# EAGLE design Wasserstandsmelder1 (EAGLE 5.04)
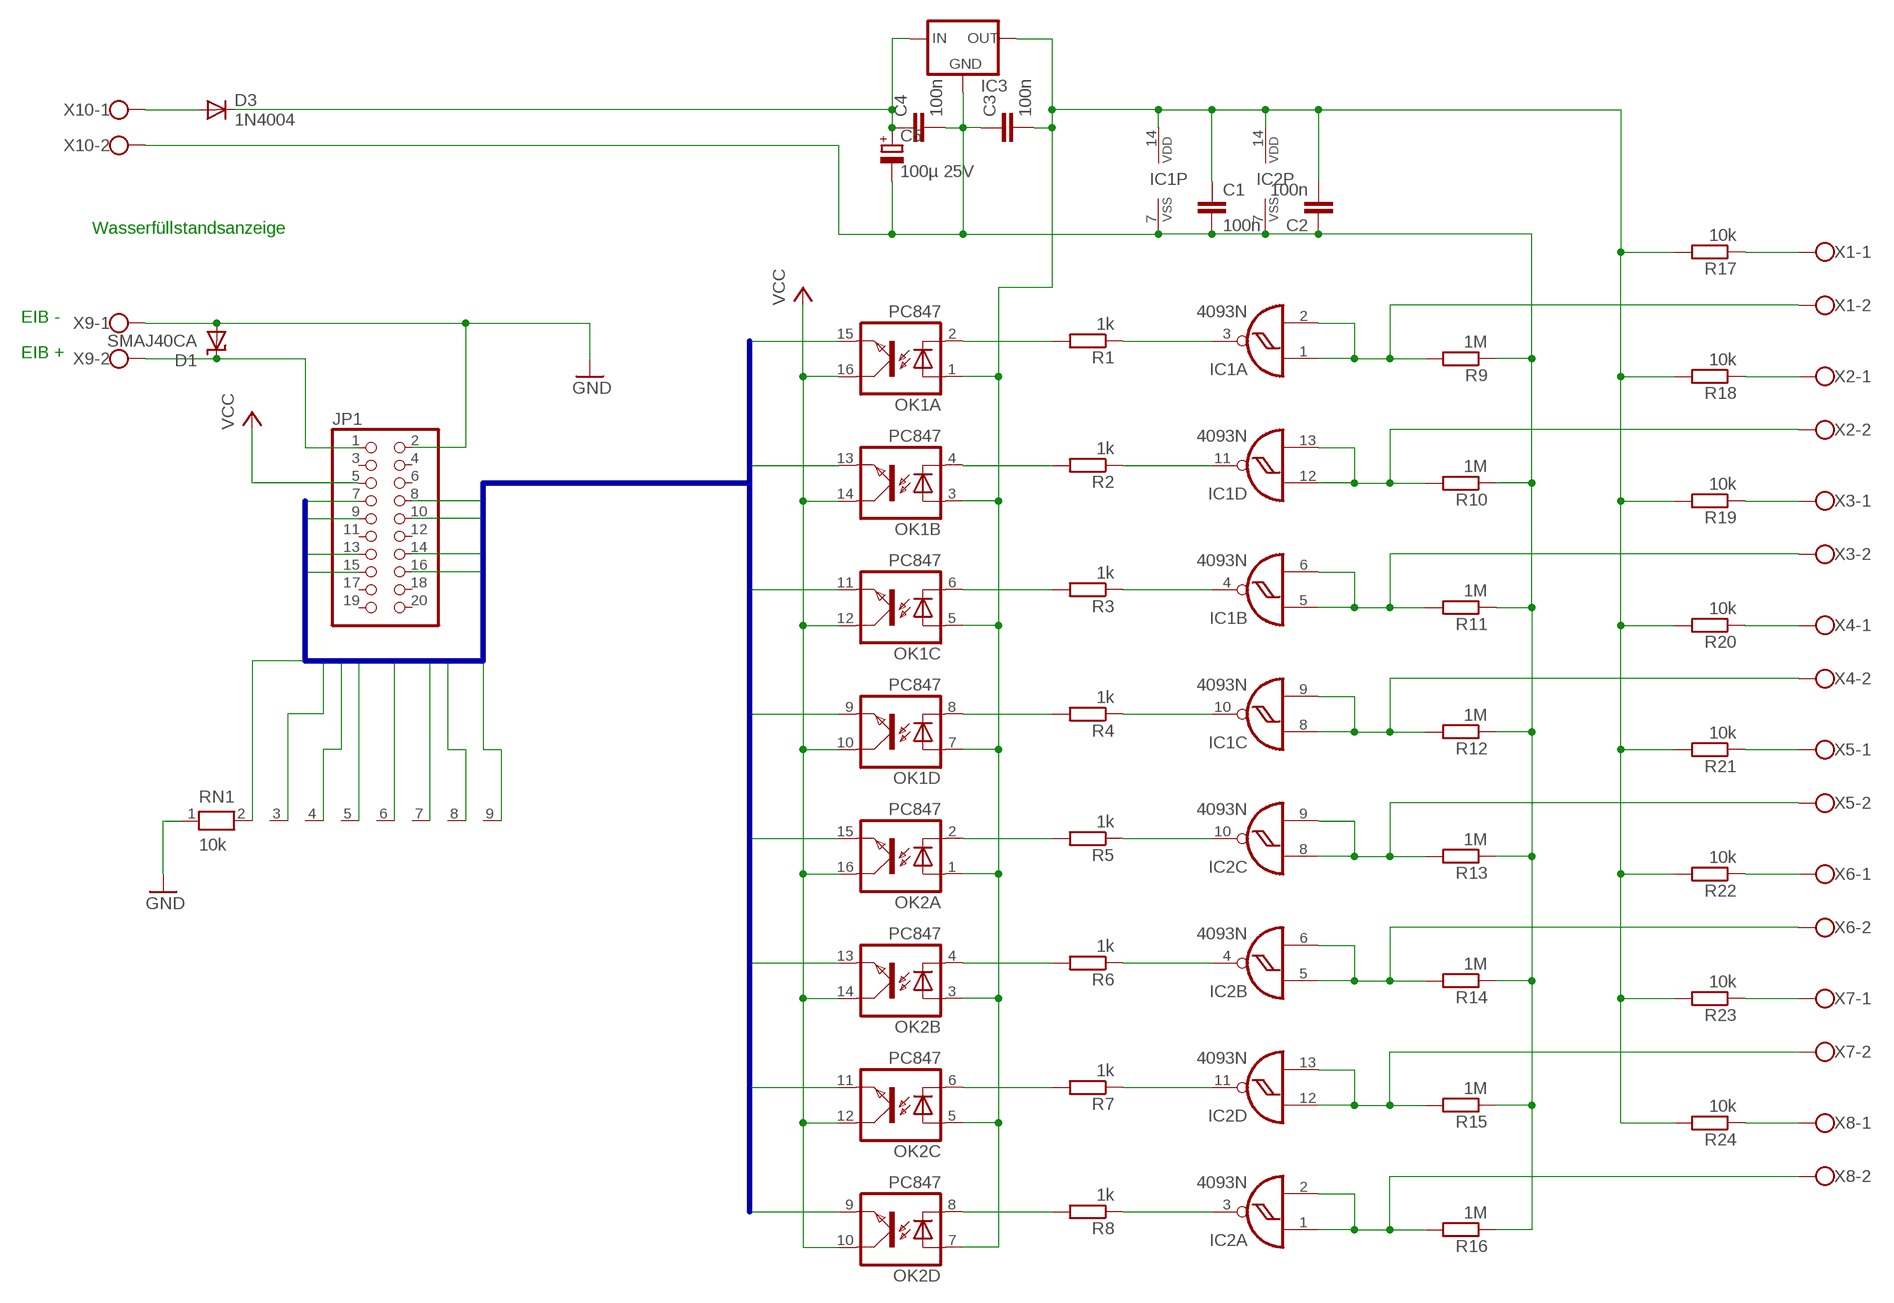
[diagram p0: schematic, sheet 1]

## Parts
C1  100n  C-EU050-024X044  [C050-024X044]
C2  100n  C-EU050-024X044  [C050-024X044]
C3  100n  C-EU050-024X044  [C050-024X044]
C4  100n  C-EU050-024X044  [C050-024X044]
C5  100µ 25V  CPOL-EUE3.5-8  [E3,5-8]
D1  SMAJ40CA  SUPPRESSOR-SMBJ  [SMBJ]
D3  1N4004  [DO41-10]
IC1  4093N  [DIL14]
IC2  4093N  [DIL14]
IC3  78XXS  [78XXS]
JP1  PINHD-2X10  [2X10]
OK1  PC847  [DIL16]
OK2  PC847  [DIL16]
R1  1k  R-EU_0204/7  [0204/7]
R2  1k  R-EU_0204/7  [0204/7]
R3  1k  R-EU_0204/7  [0204/7]
R4  1k  R-EU_0204/7  [0204/7]
R5  1k  R-EU_0204/7  [0204/7]
R6  1k  R-EU_0204/7  [0204/7]
R7  1k  R-EU_0204/7  [0204/7]
R8  1k  R-EU_0204/7  [0204/7]
R9  1M  R-EU_0204/7  [0204/7]
R10  1M  R-EU_0204/7  [0204/7]
R11  1M  R-EU_0204/7  [0204/7]
R12  1M  R-EU_0204/7  [0204/7]
R13  1M  R-EU_0204/7  [0204/7]
R14  1M  R-EU_0204/7  [0204/7]
R15  1M  R-EU_0204/7  [0204/7]
R16  1M  R-EU_0204/7  [0204/7]
R17  10k  R-EU_0204/7  [0204/7]
R18  10k  R-EU_0204/7  [0204/7]
R19  10k  R-EU_0204/7  [0204/7]
R20  10k  R-EU_0204/7  [0204/7]
R21  10k  R-EU_0204/7  [0204/7]
R22  10k  R-EU_0204/7  [0204/7]
R23  10k  R-EU_0204/7  [0204/7]
R24  10k  R-EU_0204/7  [0204/7]
RN1  10k  RN08  [RN-9]
X1  W237-02P  [W237-132]
X2  W237-02P  [W237-132]
X3  W237-02P  [W237-132]
X4  W237-02P  [W237-132]
X5  W237-02P  [W237-132]
X6  W237-02P  [W237-132]
X7  W237-02P  [W237-132]
X8  W237-02P  [W237-132]
X9  W237-102  [W237-102]
X10  W237-02P  [W237-132]

## Nets
GND: D1.A JP1.2 RN1.1 X9.1
IO1: JP1.7 OK1.15(A:EMIT) RN1.9
IO2: JP1.8 OK1.13(B:EMIT) RN1.8
IO3: JP1.9 OK1.11(C:EMIT) RN1.7
IO4: JP1.10 OK1.9(D:EMIT) RN1.6
IO5: JP1.13 OK2.15(A:EMIT) RN1.5
IO6: JP1.14 OK2.13(B:EMIT) RN1.4
IO7: JP1.15 OK2.11(C:EMIT) RN1.3
IO8: JP1.16 OK2.9(D:EMIT) RN1.2
N$1: OK1.2(A:C) R1.2
N$2: IC1.1(A:I0) IC1.2(A:I1) R9.2 X1.2
N$3: IC1.12(D:I0) IC1.13(D:I1) R10.2 X2.2
N$4: IC1.5(B:I0) IC1.6(B:I1) R11.2 X3.2
N$5: D3.A X10.1
N$6: IC1.8(C:I0) IC1.9(C:I1) R12.2 X4.2
N$7: IC2.8(C:I0) IC2.9(C:I1) R13.2 X5.2
N$8: IC2.5(B:I0) IC2.6(B:I1) R14.2 X6.2
N$9: IC2.12(D:I0) IC2.13(D:I1) R15.2 X7.2
N$10: IC2.1(A:I0) IC2.2(A:I1) R16.2 X8.2
N$11: R17.1 X1.1
N$12: R18.1 X2.1
N$13: R19.1 X3.1
N$14: R20.1 X4.1
N$15: R21.1 X5.1
N$16: R22.1 X6.1
N$17: R23.1 X7.1
N$18: R24.1 X8.1
N$19: IC1.10(C:O) R4.1
N$20: OK1.4(B:C) R2.2
N$21: IC1.3(A:O) R1.1
N$22: OK1.6(C:C) R3.2
N$23: IC1.11(D:O) R2.1
N$24: OK1.8(D:C) R4.2
N$25: IC1.4(B:O) R3.1
N$26: OK2.2(A:C) R5.2
N$27: IC2.10(C:O) R5.1
N$28: OK2.4(B:C) R6.2
N$29: IC2.4(B:O) R6.1
N$30: OK2.6(C:C) R7.2
N$31: IC2.11(D:O) R7.1
N$32: OK2.8(D:C) R8.2
N$33: IC2.3(A:O) R8.1
N$35: C4.1 C5.+ D3.C IC3.IN
N$38: D1.C JP1.1 X9.2
VCC: JP1.5 OK1.10(D:COL) OK1.12(C:COL) OK1.14(B:COL) OK1.16(A:COL) OK2.10(D:COL) OK2.12(C:COL) OK2.14(B:COL) OK2.16(A:COL)
VDD: C1.1 C2.2 C3.2 IC1.14(P:VDD) IC2.14(P:VDD) IC3.OUT OK1.1(A:A) OK1.3(B:A) OK1.5(C:A) OK1.7(D:A) OK2.1(A:A) OK2.3(B:A) OK2.5(C:A) OK2.7(D:A) R17.2 R18.2 R19.2 R20.2 R21.2 R22.2 R23.2 R24.2
VSS: C1.2 C2.1 C3.1 C4.2 C5.- IC1.7(P:VSS) IC2.7(P:VSS) IC3.GND R9.1 R10.1 R11.1 R12.1 R13.1 R14.1 R15.1 R16.1 X10.2
Unconnected: JP1.3 JP1.4 JP1.6 JP1.11 JP1.12 JP1.17 JP1.18 JP1.19 JP1.20

## Buses
IO[1..8]

## Notes on the sheet
- Wasserfüllstandsanzeige
- EIB -
- EIB +

## Library data of the parts
C1-C4 = rcl:C-EU: CAPACITOR, European symbol
C5 = rcl:CPOL-EU: POLARIZED CAPACITOR, European symbol
D1 = diode:SUPPRESSOR-: Suppressor diode
D3 = diode:1N4004: DIODE general purpose rectifier, 1 A
IC1 IC2 = 40xx:4093: Quad 2-input NAND schmitt trigger
IC3 = v-reg:78XXS: VOLTAGE REGULATOR
JP1 = pinhead:PINHD-2X10: PIN HEADER
OK1 OK2 = optocoupler:PC847: SHARP OPTO COUPLER
R1-R24 = rcl:R-EU_: RESISTOR, European symbol
RN1 = resistor-net:RN08: RESISTOR NETWORK
X1-X8 X10 = con-wago-508:W237-02P: WAGO SREW CLAMP
X9 = con-wago-500:W237-102: WAGO SCREW CLAMP

## Board
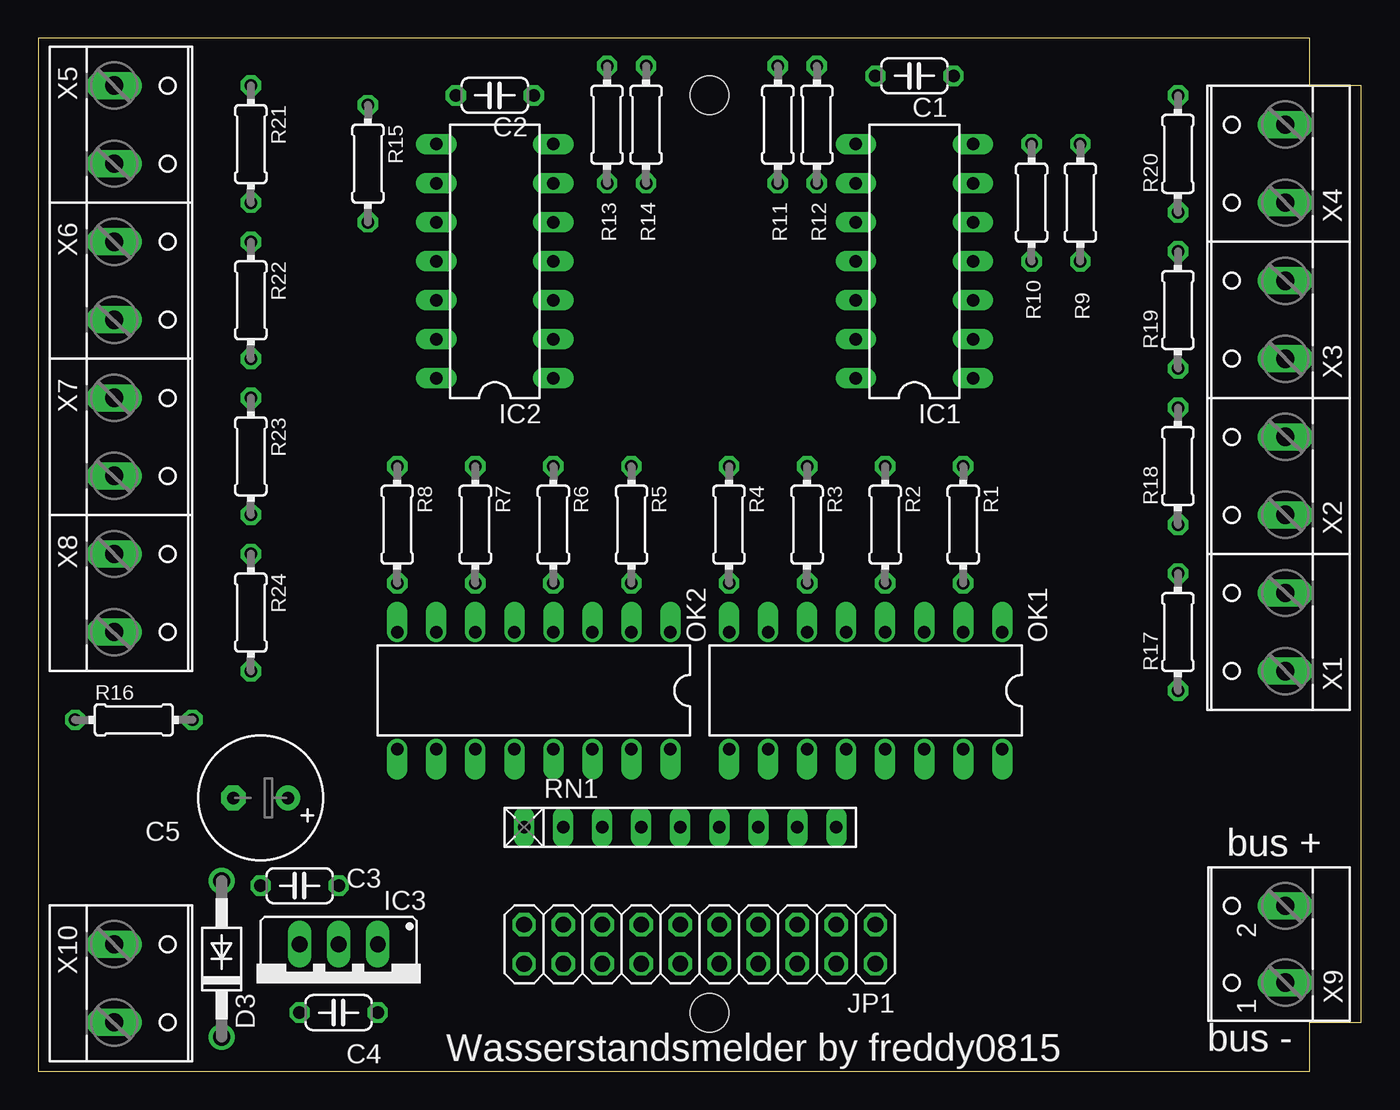
[diagram p1: board, top side]
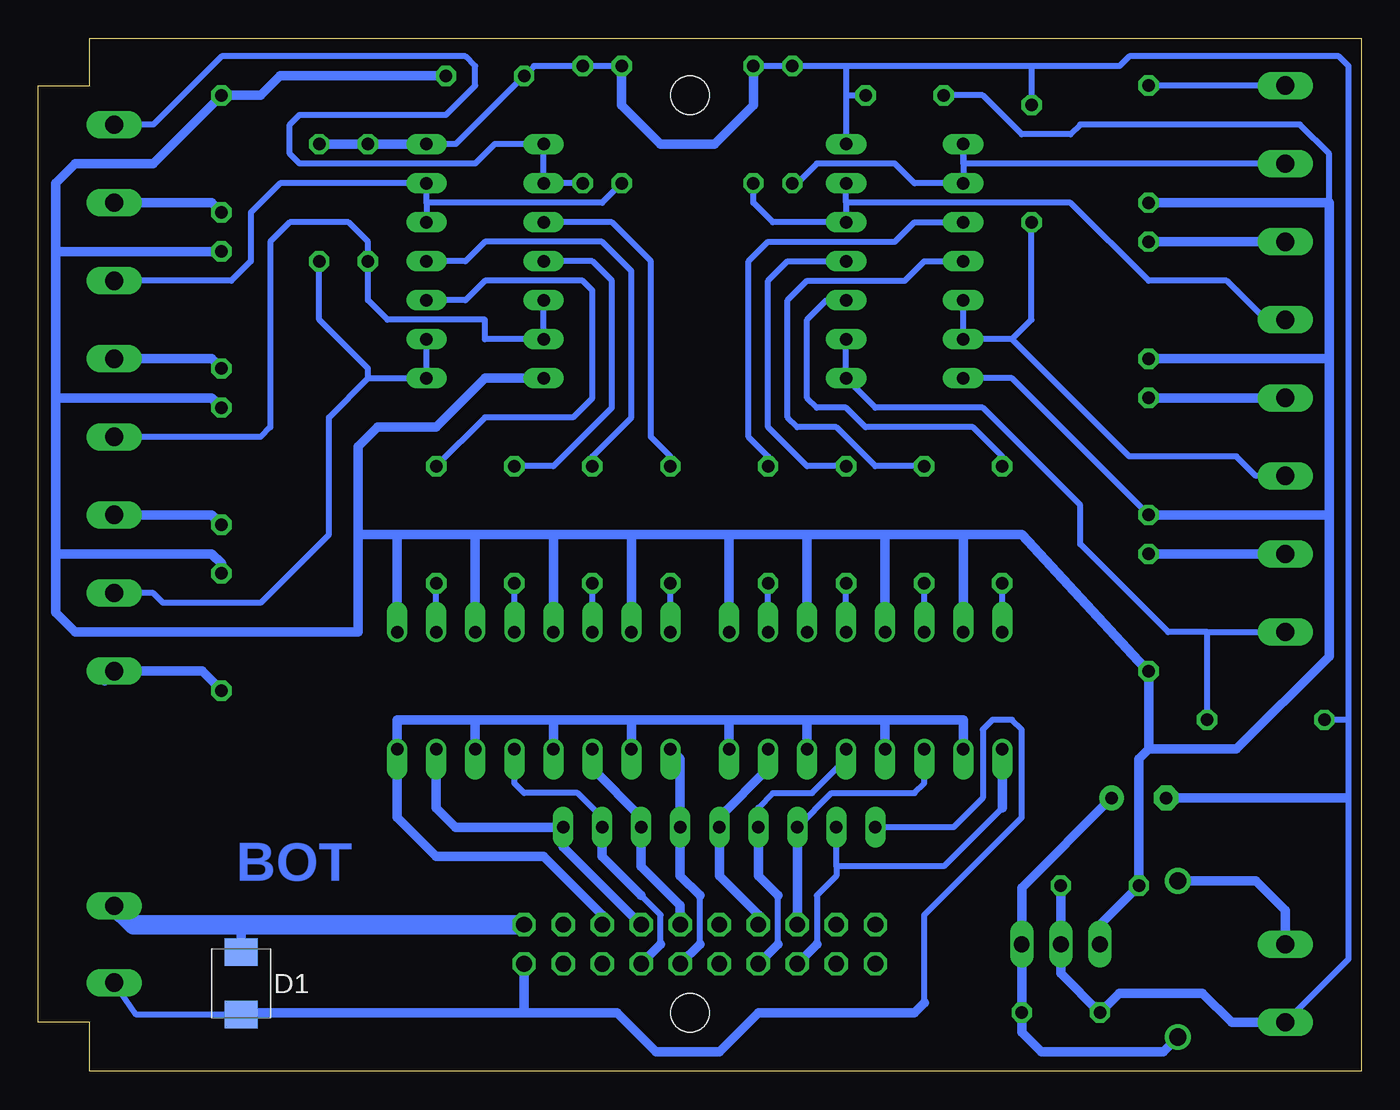
[diagram p2: board, bottom side, seen from below]

Size 86.07 x 67.2 mm. Coordinates in mm from the lower left corner, seen from the top.
Outline: 0,0.01 82.72,0 82.72,3.18 86.07,3.18 86.07,64.13 82.72,64.13 82.72,67.2 0,67.2 0,0.01
Copper layers (1*16): Top 0.035mm / dielectric 1.5mm / Bottom 0.035mm
Design rules "default *": minimum track width 10mil, minimum drill 24mil, track to track 8mil, track to pad 8mil, pad to pad 16mil, via to via 16mil, smd to smd 16mil, copper to edge 20mil, drill to drill 10mil, minimum pad ring 10mil, minimum via ring 8mil, stop-mask expansion 4mil, vias tented up to drill 0mil, thermal gap 10mil
Holes 2.5 mm at 43.67,63.5 43.67,3.81

### Footprints (pad centres in the part's own frame; a part is rotated, then mirrored left to right if it is on the bottom)
C050-024X044 = drill 0.813 octagon: 1 -2.54,0; 2 2.54,0
E3,5-8 = drill 0.813 pad 1.6 round: + -1.778,0 | drill 0.813 pad 1.6 octagon: - 1.778,0
SMBJ = smd 1.78 x 2.16: A 2.04,0; C -2.03,0
DO41-10 = drill 1.118 round: A 5.08,0; C -5.08,0
DIL14 = drill 0.813 long: 1 -7.62,-3.81; 2 -5.08,-3.81; 3 -2.54,-3.81; 4 0,-3.81; 5 2.54,-3.81; 6 5.08,-3.81; 7 7.62,-3.81; 8 7.62,3.81; 9 5.08,3.81; 10 2.54,3.81; 11 0,3.81; 12 -2.54,3.81; 13 -5.08,3.81; 14 -7.62,3.81
78XXS = drill 1.016 long: GND 0,-2.54; IN -2.54,-2.54; OUT 2.54,-2.54
2X10 = drill 1.016 octagon: 1 -11.43,-1.27; 2 -11.43,1.27; 3 -8.89,-1.27; 4 -8.89,1.27; 5 -6.35,-1.27; 6 -6.35,1.27; 7 -3.81,-1.27; 8 -3.81,1.27; 9 -1.27,-1.27; 10 -1.27,1.27; 11 1.27,-1.27; 12 1.27,1.27; 13 3.81,-1.27; 14 3.81,1.27; 15 6.35,-1.27; 16 6.35,1.27; 17 8.89,-1.27; 18 8.89,1.27; 19 11.43,-1.27; 20 11.43,1.27
DIL16 = drill 0.813 offset: 1 -8.89,-3.81; 2 -6.35,-3.81; 3 -3.81,-3.81; 4 -1.27,-3.81; 5 1.27,-3.81; 6 3.81,-3.81; 7 6.35,-3.81; 8 8.89,-3.81; 9 8.89,3.81; 10 6.35,3.81; 11 3.81,3.81; 12 1.27,3.81; 13 -1.27,3.81; 14 -3.81,3.81; 15 -6.35,3.81; 16 -8.89,3.81
0204/7 = drill 0.813 octagon: 1 -3.81,0; 2 3.81,0
RN-9 = drill 0.813 long: 1 -10.16,0; 2 -7.62,0; 3 -5.08,0; 4 -2.54,0; 5 0,0; 6 2.54,0; 7 5.08,0; 8 7.62,0; 9 10.16,0
W237-132 = drill 1.194 long: 1 -2.54,-0.635; 2 2.54,-0.635
W237-102 = drill 1.194 long: 1 -2.5,-1.27; 2 2.5,-1.27

### Placement (x,y rotation side)
C1  57,64.77 180 top
C2  29.7,63.5 180 top
C3  17,12.06 180 top
C4  19.54,3.81 180 top
C5  14.46,17.78 180 top
D1  72.88,5.71 270 bottom
D3  11.92,7.3 90 top
IC1  57,52.7 90 top
IC2  29.7,52.7 90 top
IC3  19.54,5.71 180 top
JP1  43.03,8.26 180 top
OK1  53.83,24.77 180 top
OK2  32.24,24.77 180 top
R1  60.18,35.56 270 top
R2  55.1,35.56 270 top
R3  50.02,35.56 270 top
R4  44.94,35.56 270 top
R5  38.59,35.56 270 top
R6  33.51,35.56 270 top
R7  28.43,35.56 270 top
R8  23.35,35.56 270 top
R9  67.8,56.52 270 top
R10  64.62,56.52 270 top
R11  48.11,61.59 270 top
R12  50.65,61.59 270 top
R13  37,61.59 270 top
R14  39.54,61.59 270 top
R15  21.44,59.05 270 top
R16  6.2,22.86 0 top
R17  74.15,28.58 90 top
R18  74.15,39.37 90 top
R19  74.15,49.53 90 top
R20  74.15,59.69 90 top
R21  13.82,60.32 270 top
R22  13.82,50.16 270 top
R23  13.82,40 270 top
R24  13.82,29.85 270 top
RN1  41.76,15.88 0 top
X1  80.5,28.58 90 top
X2  80.5,38.73 90 top
X3  80.5,48.89 90 top
X4  80.5,59.05 90 top
X5  5.57,61.59 270 top
X6  5.57,51.43 270 top
X7  5.57,41.27 270 top
X8  5.57,31.12 270 top
X9  79.86,8.26 90 top
X10  5.57,5.71 270 top

### Tracks (layer width: path | path; a pad name or v marks a point on that pad's centre or on a via)
GND
  Bottom 0.406: D1.A 79.69,3.67 X9.1 | 28.43,4.45 28.43,10.16 22.08,16.51 22.08,22.23 22.71,22.86 23.98,22.86 24.62,22.23 24.62,17.78 26.52,15.88 RN1.1
  Bottom 0.61: 54.46,3.81 JP1.2 | 54.46,3.81 72.74,3.81 D1.A | 54.46,3.81 48.43,3.81 45.89,1.27 41.76,1.27 39.22,3.81 29.06,3.81 28.43,4.45
IO1
  Bottom 0.406: 51.92,14.61 RN1.9
  Bottom 0.61: JP1.7 51.92,14.61 | RN1.9 58.91,15.88 60.18,17.15 OK1.15
IO2
  Bottom 0.406: 45.57,8.26 45.57,10.16 46.84,11.43 | 49.38,16.51 50.97,18.1 54.46,18.1 55.1,18.73 55.1,20.32
  Bottom 0.61: JP1.8 45.57,8.26 | 46.84,11.43 49.38,13.97 RN1.8 49.38,16.51 | 55.1,20.32 OK1.13
IO3
  Bottom 0.61: JP1.9 44.3,10.79 46.84,13.33 RN1.7 46.84,16.51 50.02,19.69 OK1.11
IO4
  Bottom 0.406: 43.03,8.26 43.03,11.43
  Bottom 0.61: JP1.10 43.03,8.26 | 43.03,11.43 44.3,12.7 RN1.6 44.3,19.05 44.3,20.32 OK1.9
IO5
  Bottom 0.61: JP1.13 39.22,10.16 41.76,12.7 RN1.5 41.76,16.51 38.59,19.69 OK2.15
IO6
  Bottom 0.406: 37.95,8.26 37.95,11.43 | RN1.4 39.22,17.15 38.27,18.1 35.73,18.1 33.51,20.32 OK2.13
  Bottom 0.61: JP1.14 37.95,8.26 | 37.95,11.43 39.22,12.7 RN1.4
IO7
  Bottom 0.406: RN1.3 34.46,18.1 29.06,18.1 28.43,18.73 OK2.11
  Bottom 0.61: JP1.15 RN1.3
IO8
  Bottom 0.406: 35.41,8.26 35.41,11.43 34.14,12.7 34.14,13.33 | 34.14,13.33 RN1.2 | 23.35,17.15 27.16,13.33 34.14,13.33
  Bottom 0.61: 23.35,17.15 OK2.9 | 35.41,8.26 JP1.16
N$1
  Bottom 0.406: OK1.2 R1.2
N$2
  Bottom 0.406: IC1.2 IC1.1 64.62,45.09 | 64.62,45.09 67.16,42.54 67.16,34.92 71.61,30.48 77.96,30.48 78.59,31.12 80.5,31.12 | 64.62,45.09 64.62,45.72 67.8,48.89 R9.2
  Bottom 0.61: 79.86,31.12 80.5,31.12 X1.2
N$3
  Bottom 0.406: IC1.12 IC1.13 57,47.62 57,48.89 63.35,48.89 64.62,50.16 R10.2 64.62,53.98 65.89,55.24 69.7,55.24 70.97,53.98 70.97,41.91 71.61,41.27 X2.2
N$4
  Bottom 0.406: 60.81,56.52 IC1.5 | 60.81,56.52 IC1.6 70.34,57.78 72.24,55.88 72.24,52.7 73.51,51.43 X3.2 | R11.2 49.38,56.52 60.81,56.52
  Bottom 0.61: X3.2 80.5,51.43
N$5
  Bottom 0.61: D3.A 6.84,12.38 4.93,10.48 X10.1
N$6
  Bottom 0.406: R12.2 IC1.9 IC1.8 56.37,60.32 57.64,59.05 69.07,59.05 69.7,59.69 69.7,61.59 69.07,62.23 59.54,62.23 57.64,64.14 57.64,65.41 58.27,66.04 74.15,66.04 78.59,61.59 X4.2
N$7
  Bottom 0.406: X5.2 25.89,59.05 IC2.8 IC2.9 29.06,57.78 30.33,59.05 35.41,59.05 36.68,57.78 R13.2
N$8
  Bottom 0.406: 6.2,48.89 8.74,51.43 13.82,51.43 18.9,56.52 33.51,56.52 | 33.51,56.52 IC2.5 38.27,55.24 39.54,56.52 R14.2 | 33.51,56.52 IC2.6
  Bottom 0.61: X6.2 6.2,48.89
N$9
  Bottom 0.406: X7.2 6.84,38.73 8.11,40 14.46,40 15.09,40 22.71,47.62 | 22.71,47.62 IC2.13 IC2.12 | R15.2 21.44,48.89 22.71,47.62
N$10
  Bottom 0.406: IC2.2 IC2.1 31.6,43.18 24.62,43.18 18.27,36.83 18.27,34.29 12.55,28.58 10.01,28.58 | 10.01,28.58 X8.2 | R16.2 10.01,28.58
N$11
  Bottom 0.61: 81.77,25.4 X1.1 75.42,26.04 R17.1
N$12
  Bottom 0.61: X2.1 74.78,36.2 R18.1
N$13
  Bottom 0.61: 81.77,46.35 X3.1 74.78,46.35 R19.1
N$14
  Bottom 0.61: X4.1 74.78,56.52 R20.1
N$15
  Bottom 0.406: X5.1 R21.1
N$16
  Bottom 0.61: X6.1 R22.1
N$17
  Bottom 0.61: X7.1 10.65,43.81 R23.1
N$18
  Bottom 0.61: X8.1 R24.1
N$19
  Bottom 0.406: IC1.10 48.75,55.24 46.21,52.7 46.21,41.27 44.94,40 R4.1
N$20
  Bottom 0.406: OK1.4 R2.2
N$21
  Bottom 0.406: IC1.3 58.27,50.16 57,51.43 50.65,51.43 50.02,50.8 50.02,43.81 51.29,42.54 57,42.54 R1.1
N$22
  Bottom 0.406: OK1.6 R3.2
N$23
  Bottom 0.406: IC1.11 50.02,52.7 48.75,51.43 48.75,43.18 52.56,39.37 R2.1
N$24
  Bottom 0.406: OK1.8 R4.2
N$25
  Bottom 0.406: IC1.4 58.27,52.7 57,53.98 49.38,53.98 47.48,52.07 47.48,42.54 50.02,40 R3.1
N$26
  Bottom 0.406: OK2.2 R5.2
N$27
  Bottom 0.406: IC2.10 29.06,55.24 30.33,53.98 38.59,53.98 39.86,52.7 39.86,41.27 38.59,40 R5.1
N$28
  Bottom 0.406: OK2.4 R6.2
N$29
  Bottom 0.406: R6.1 36.05,39.37 38.59,41.91 38.59,51.43 37.32,52.7 IC2.4
N$30
  Bottom 0.406: OK2.6 R7.2
N$31
  Bottom 0.406: IC2.11 28.43,52.7 29.7,51.43 36.05,51.43 37.32,50.16 37.32,42.54 36.68,41.91 34.14,41.91 31.6,39.37 R7.1
N$32
  Bottom 0.406: OK2.8 R8.2
N$33
  Bottom 0.406: IC2.3 34.78,50.16 36.05,48.89 36.05,43.81 35.41,43.18 33.51,43.18 32.24,41.91 25.25,41.91 23.35,40 R8.1
N$35
  Bottom 0.61: D3.C 12.87,1.27 20.81,1.27 22.08,2.54 C4.1 IC3.IN 22.08,11.93 C5.+
N$38
  Bottom 0.61: 72.88,9.53 72.88,7.78 D1.C
  Bottom 1.27: JP1.1 72.88,9.53 79.86,9.53 X9.2
VCC
  Bottom 0.61: JP1.5 49.38,10.16 53.19,13.97 60.18,13.97 62.72,16.51 OK1.16 62.72,22.86 57.64,22.86 | 57.64,22.86 OK1.14 57.64,22.86 | 52.56,22.86 57.64,22.86 | 52.56,22.86 OK1.12 52.56,22.86 | 47.48,22.86 52.56,22.86 | 47.48,22.86 OK1.10 47.48,22.86 | 41.13,22.86 47.48,22.86 | 41.13,22.86 OK2.16 41.13,22.86 | 36.05,22.86 41.13,22.86 | 36.05,22.86 OK2.14 36.05,22.86 | 30.97,22.86 36.05,22.86 | 30.97,22.86 OK2.12 30.97,22.86 | 30.97,22.86 25.89,22.86 OK2.10
VDD
  Bottom 0.406: 2.08,56.52 2.08,59.69 3.98,61.59 18.27,61.59 18.9,60.96 22.08,60.96 24.62,63.5 C2.2 | IC2.14 22.71,45.09 R23.2
  Bottom 0.61: 13.82,20.96 R24.2 14.46,26.67 22.08,34.92 25.89,34.92 | 2.08,36.2 R23.2 | 2.08,36.2 2.08,46.35 | 2.08,46.35 R22.2 | 2.08,46.35 2.08,56.52 R21.2 | R17.2 74.15,33.02 74.78,33.66 84.94,33.66 | 84.94,33.66 84.94,43.81 | R18.2 74.78,43.81 84.94,43.81 | 84.94,43.81 84.94,53.34 | 84.94,53.34 R19.2 | IC1.14 57,45.09 60.18,41.91 63.99,41.91 65.26,40.64 65.26,34.92 | 65.26,34.92 65.26,28.58 83.67,28.58 84.94,29.85 84.94,33.66 | C1.1 70.34,64.77 71.61,63.5 R20.2 78.59,59.05 83.67,59.05 84.94,57.78 84.94,53.34 | 25.89,34.92 30.97,34.92 | 30.97,34.92 36.05,34.92 | 36.05,34.92 41.13,34.92 | 41.13,34.92 47.48,34.92 | 47.48,34.92 52.56,34.92 | 52.56,34.92 57.64,34.92 | 57.64,34.92 62.72,34.92 | 62.72,34.92 65.26,34.92 | 62.72,34.92 OK1.1 | 57.64,34.92 OK1.3 | 52.56,34.92 OK1.5 | 47.48,34.92 OK1.7 | 41.13,34.92 OK2.1 | 36.05,34.92 OK2.3 | 30.97,34.92 OK2.5 | 25.89,34.92 OK2.7 | 2.08,36.2 2.08,26.99 8.11,20.96 13.82,20.96 | IC3.OUT 17,9.53 C3.2 14.46,20.32 13.82,20.96
VSS
  Bottom 0.406: IC1.7 58.91,60.32 C1.2 53.83,65.41 R12.1 R11.1 | R14.1 R13.1 33.51,65.41 | 33.51,63.5 C2.1 | 33.51,63.5 IC2.7 | 33.51,65.41 33.51,63.5 | 0.81,17.78 0.81,22.86 | 0.81,22.86 0.81,65.41 1.44,66.04 15.09,66.04 15.73,65.41 21.44,65.41 | 21.44,65.41 R15.1 | 21.44,65.41 33.51,65.41 | 0.81,22.86 R16.1 | 0.81,17.78 0.96,17.78 | 0.81,17.78 0.81,7.3 X10.2
  Bottom 0.61: IC1.7 R10.1 R9.1 | C3.1 IC3.GND 19.54,6.35 C4.2 15.73,5.08 10.33,5.08 8.42,3.17 X10.2 | R14.1 39.54,62.86 42.08,60.32 45.57,60.32 48.11,62.86 R11.1 | 0.96,17.78 C5.-

### Text on the board
Bottom: BOT
tPlace: bus + | bus - | Wasserstandsmelder by freddy0815